# EAGLE design adapter (EAGLE 6.6.0)
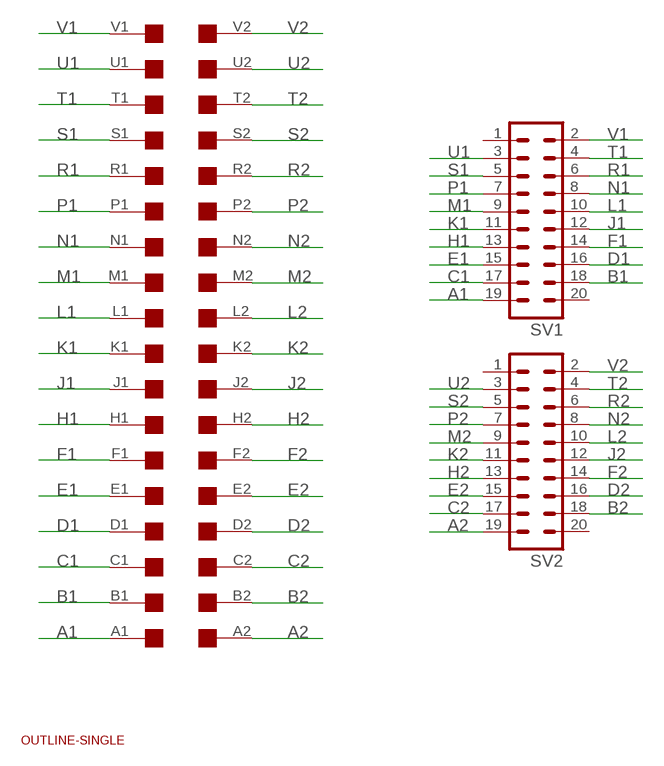
[diagram p0: schematic, sheet 1]

## Parts
SV1  MA10-2W  [MA10-2W]
SV2  MA10-2W  [MA10-2W]
U$1  OUTLINE-SINGLE  [SINGLE]
U$2  SINGLE  [EDGE-CON2]

## Nets
A1: SV1.19 U$2.A1
A2: SV2.19 U$2.A2
B1: SV1.18 U$2.B1
B2: SV2.18 U$2.B2
C1: SV1.17 U$2.C1
C2: SV2.17 U$2.C2
D1: SV1.16 U$2.D1
D2: SV2.16 U$2.D2
E1: SV1.15 U$2.E1
E2: SV2.15 U$2.E2
F1: SV1.14 U$2.F1
F2: SV2.14 U$2.F2
H1: SV1.13 U$2.H1
H2: SV2.13 U$2.H2
J1: SV1.12 U$2.J1
J2: SV2.12 U$2.J2
K1: SV1.11 U$2.K1
K2: SV2.11 U$2.K2
L1: SV1.10 U$2.L1
L2: SV2.10 U$2.L2
M1: SV1.9 U$2.M1
M2: SV2.9 U$2.M2
N1: SV1.8 U$2.N1
N2: SV2.8 U$2.N2
P1: SV1.7 U$2.P1
P2: SV2.7 U$2.P2
R1: SV1.6 U$2.R1
R2: SV2.6 U$2.R2
S1: SV1.5 U$2.S1
S2: SV2.5 U$2.S2
T1: SV1.4 U$2.T1
T2: SV2.4 U$2.T2
U1: SV1.3 U$2.U1
U2: SV2.3 U$2.U2
V1: SV1.2 U$2.V1
V2: SV2.2 U$2.V2
Unconnected: SV1.1 SV1.20 SV2.1 SV2.20

## Library data of the parts
SV1 SV2 = con-lstb:MA10-2W: PIN HEADER; OC_FARNELL: unknown; OC_NEWARK: unknown
U$1 = dec-con:OUTLINE-*: Board outlines for DEC boards.
U$2 = dec-con:SINGLE: Single-Height DEC board

## Board
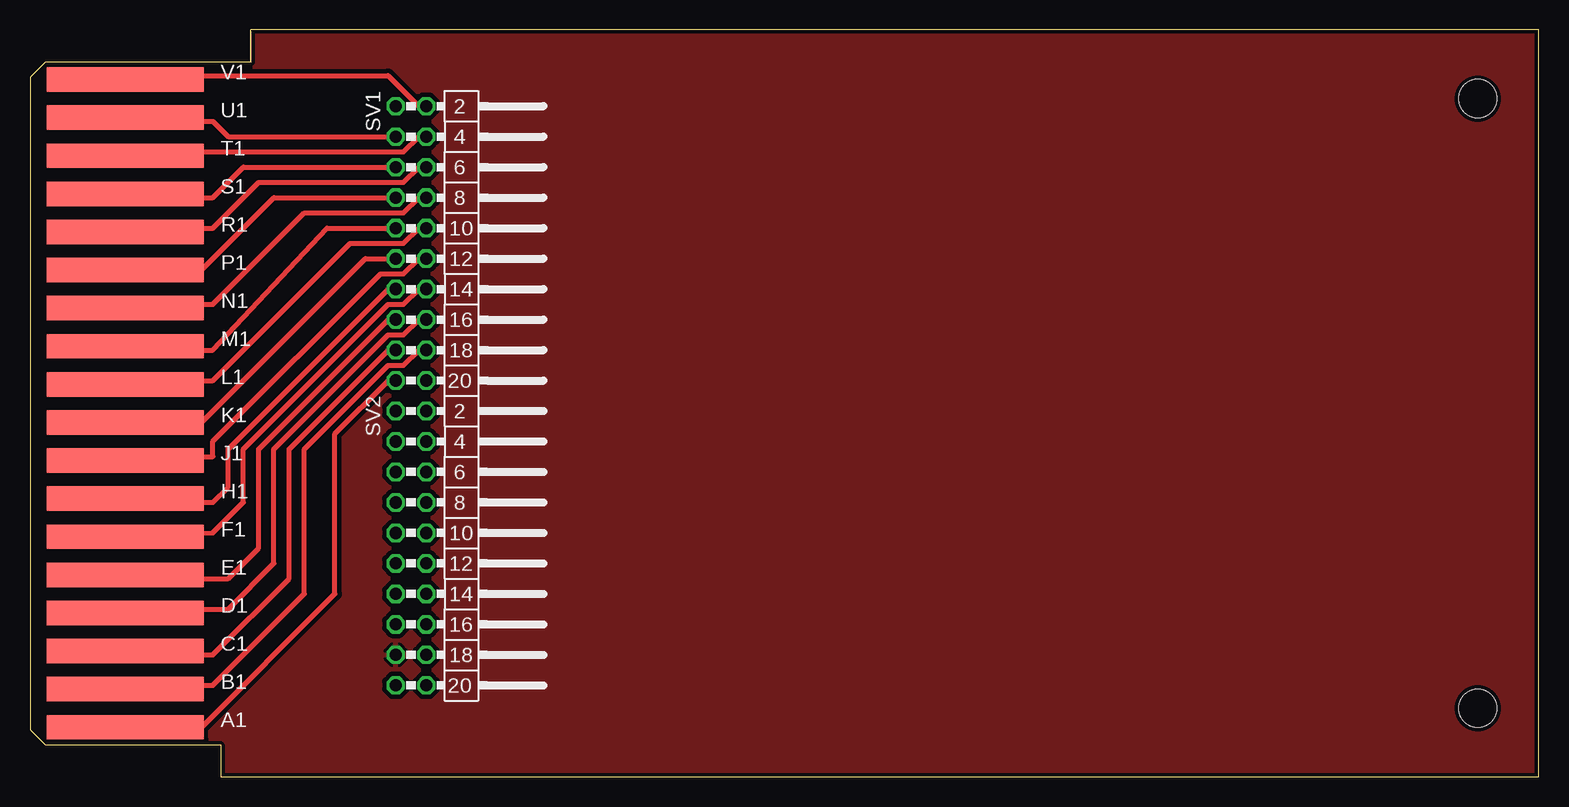
[diagram p1: board, top side]
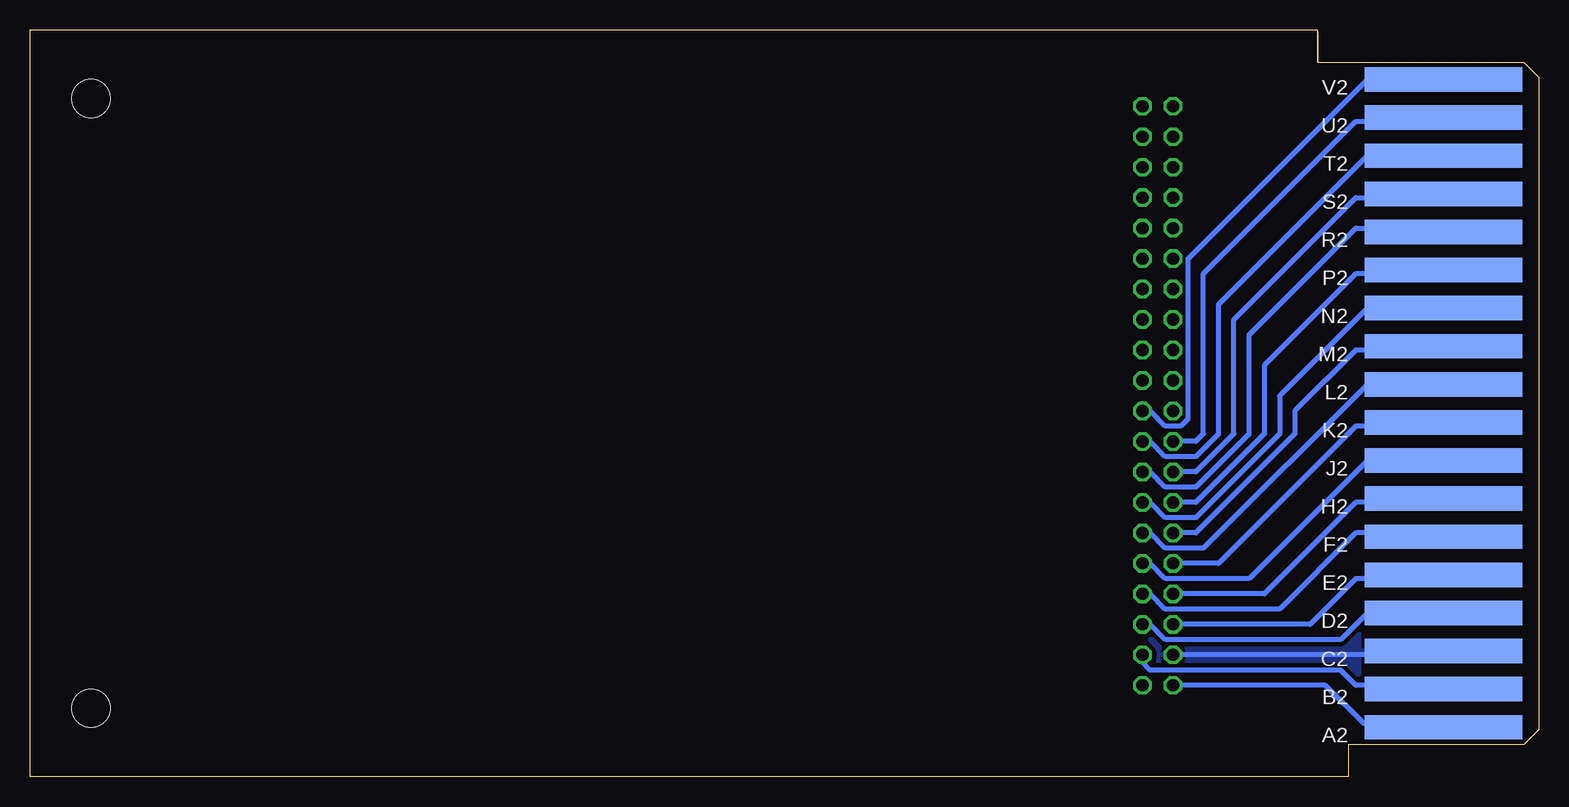
[diagram p2: board, bottom side, seen from below]

Size 125.73 x 62.23 mm. Coordinates in mm from the lower left corner, seen from the top.
Copper layers (1+16): Top 0.035mm / dielectric 1.5mm / Bottom 0.035mm
Design rules "16mils": minimum track width 16mil, minimum drill 32mil, track to track 15mil, track to pad 10mil, pad to pad 10mil, via to via 10mil, smd to smd 10mil, copper to edge 13mil, drill to drill 10mil, minimum pad ring 10mil, minimum via ring 8mil, stop-mask expansion 0mil, vias tented up to drill 0mil, thermal gap 10mil

### Footprints (pad centres in the part's own frame; a part is rotated, then mirrored left to right if it is on the bottom)
MA10-2W = drill 1.016 octagon: 1 -11.43,-1.27; 2 -11.43,1.27; 3 -8.89,-1.27; 4 -8.89,1.27; 5 -6.35,-1.27; 6 -6.35,1.27; 7 -3.81,-1.27; 8 -3.81,1.27; 9 -1.27,-1.27; 10 -1.27,1.27; 11 1.27,-1.27; 12 1.27,1.27; 13 3.81,-1.27; 14 3.81,1.27; 15 6.35,-1.27; 16 6.35,1.27; 17 8.89,-1.27; 18 8.89,1.27; 19 11.43,-1.27; 20 11.43,1.27
SINGLE = hole 3.175: 120.65,56.515; 120.65,5.715
EDGE-CON2 = smd 13.106 x 2.032: A1 7.938,4.128; B1 7.938,7.303; C1 7.938,10.477; D1 7.938,13.652; E1 7.938,16.828; F1 7.938,20.003; H1 7.938,23.177; J1 7.938,26.352; K1 7.938,29.527; L1 7.938,32.703; M1 7.938,35.877; N1 7.938,39.053; P1 7.938,42.227; R1 7.938,45.403; S1 7.938,48.578; T1 7.938,51.752; U1 7.938,54.928; V1 7.938,58.102 | smd 13.106 x 2.032 bottom: A2 7.938,4.128; B2 7.938,7.303; C2 7.938,10.477; D2 7.938,13.652; E2 7.938,16.828; F2 7.938,20.003; H2 7.938,23.177; J2 7.938,26.352; K2 7.938,29.527; L2 7.938,32.703; M2 7.938,35.877; N2 7.938,39.053; P2 7.938,42.227; R2 7.938,45.403; S2 7.938,48.578; T2 7.938,51.752; U2 7.938,54.928; V2 7.938,58.102

### Placement (x,y rotation side)
SV1  31.75,44.45 270 top
SV2  31.75,19.05 270 top
U$1  0,0 0 top
U$2  0,0 0 top

### Tracks (layer width: path | path; a pad name or v marks a point on that pad's centre or on a via)
A1
  Top 0.406: SV1.19 29.85,33.02 25.4,28.57 25.4,15.24 13.97,3.81 U$2.A1
A2
  Bottom 0.406: SV2.19 17.78,7.62 14.61,4.45 U$2.A2
B1
  Top 0.406: SV1.18 32.39,35.56 31.12,34.29 29.85,34.29 22.86,27.3 22.86,15.24 15.24,7.62 13.97,7.62 U$2.B1
B2
  Bottom 0.406: SV2.18 33.02,9.53 32.39,8.89 16.51,8.89 15.24,7.62 13.97,7.62 U$2.B2
C1
  Top 0.406: SV1.17 29.85,35.56 21.59,27.3 21.59,16.51 15.24,10.16 13.97,10.16 U$2.C1
C2
  Bottom 0.406: SV2.17 13.97,10.16 U$2.C2
  pour Bottom (isolate 0.305): 13.97,0 13.97,62.23 125.73,62.23 125.73,0
  pour Top (isolate 0.305): 13.97,0 13.97,62.23 125.73,62.23 125.73,0
D1
  Top 0.406: SV1.16 32.39,38.1 31.12,36.83 29.85,36.83 20.32,27.3 20.32,17.78 16.51,13.97 13.97,13.97 U$2.D1
D2
  Bottom 0.406: SV2.16 32.39,12.7 31.12,11.43 16.51,11.43 14.61,13.34 13.97,13.97 U$2.D2
E1
  Top 0.406: SV1.15 29.85,38.1 19.05,27.3 19.05,19.05 16.51,16.51 13.97,16.51 U$2.E1
E2
  Bottom 0.406: SV2.15 19.05,12.7 15.24,16.51 13.97,16.51 U$2.E2
F1
  Top 0.406: SV1.14 32.39,40.64 31.12,39.37 29.85,39.37 17.78,27.3 17.78,22.86 15.24,20.32 U$2.F1
F2
  Bottom 0.406: SV2.14 32.39,15.24 31.12,13.97 21.59,13.97 15.24,20.32 13.97,20.32 U$2.F2
H1
  Top 0.406: SV1.13 29.85,40.64 16.51,27.3 16.51,24.13 15.24,22.86 13.97,22.86 U$2.H1
H2
  Bottom 0.406: SV2.13 22.86,15.24 15.24,22.86 13.97,22.86 U$2.H2
J1
  Top 0.406: SV1.12 32.39,43.18 31.12,41.91 29.21,41.91 15.24,27.94 15.24,26.67 13.97,26.67 U$2.J1
J2
  Bottom 0.406: SV2.12 32.39,17.78 31.12,16.51 24.13,16.51 13.97,26.67 U$2.J2
K1
  Top 0.406: SV1.11 27.94,43.18 13.97,29.21 U$2.K1
K2
  Bottom 0.406: SV2.11 26.67,17.78 15.24,29.21 13.97,29.21 U$2.K2
L1
  Top 0.406: SV1.10 32.39,45.72 31.12,44.45 26.67,44.45 15.24,33.02 13.97,33.02 U$2.L1
L2
  Bottom 0.406: SV2.10 32.39,20.32 31.12,19.05 27.94,19.05 13.97,33.02 U$2.L2
M1
  Top 0.406: SV1.9 24.77,45.72 15.24,35.56 13.97,35.56 U$2.M1
M2
  Bottom 0.406: SV2.9 28.58,20.32 20.32,28.57 20.32,30.48 15.24,35.56 13.97,35.56 U$2.M2
N1
  Top 0.406: SV1.8 32.39,48.26 31.12,46.99 22.86,46.99 15.24,39.37 13.97,39.37 U$2.N1
N2
  Bottom 0.406: SV2.8 32.39,22.86 31.12,21.59 28.58,21.59 21.59,28.57 21.59,31.75 13.97,39.37 U$2.N2
P1
  Top 0.406: SV1.7 20.32,48.26 13.97,41.91 U$2.P1
P2
  Bottom 0.406: SV2.7 28.58,22.86 22.86,28.57 22.86,34.29 15.24,41.91 13.97,41.91 U$2.P2
R1
  Top 0.406: SV1.6 32.39,50.8 31.12,49.53 19.05,49.53 15.24,45.72 13.97,45.72 U$2.R1
R2
  Bottom 0.406: SV2.6 32.39,25.4 31.12,24.13 28.58,24.13 24.13,28.57 24.13,36.83 15.24,45.72 13.97,45.72 U$2.R2
S1
  Top 0.406: SV1.5 17.78,50.8 15.24,48.26 13.97,48.26 U$2.S1
S2
  Bottom 0.406: SV2.5 28.58,25.4 25.4,28.57 25.4,38.1 15.24,48.26 13.97,48.26 U$2.S2
T1
  Top 0.406: SV1.4 32.39,53.34 31.12,52.07 13.97,52.07 U$2.T1
T2
  Bottom 0.406: SV2.4 32.39,27.94 31.12,26.67 28.58,26.67 26.67,28.57 26.67,39.37 13.97,52.07 U$2.T2
U1
  Top 0.406: SV1.3 16.51,53.34 15.24,54.61 13.97,54.61 U$2.U1
U2
  Bottom 0.406: SV2.3 28.58,27.94 27.94,28.57 27.94,41.91 15.24,54.61 13.97,54.61 U$2.U2
V1
  Top 0.406: SV1.2 32.39,55.88 29.85,58.42 13.97,58.42 U$2.V1
V2
  Bottom 0.406: 33.02,31.11 SV2.2 32.39,30.48 31.12,29.21 29.85,29.21 29.21,29.84 29.21,43.18 13.97,58.42 U$2.V2